# Altium schematic sheet microcontroller.SchDoc: Microcontroller
size A4; Date: 27.05.2014; Author: Stefan Lüthi; DrawnBy: Stefan Lüthi; Organization: BFH; Address1: Bern University of Applied Sciences; Address2: Engineering and Information Technology; Address3: Jlcoweg 1; Address4: CH-3400 Burgdorf; DocumentNumber: 1; Revision: 1.0; SheetNumber: 6; SheetTotal: 8; CurrentDate: 27.05.2014
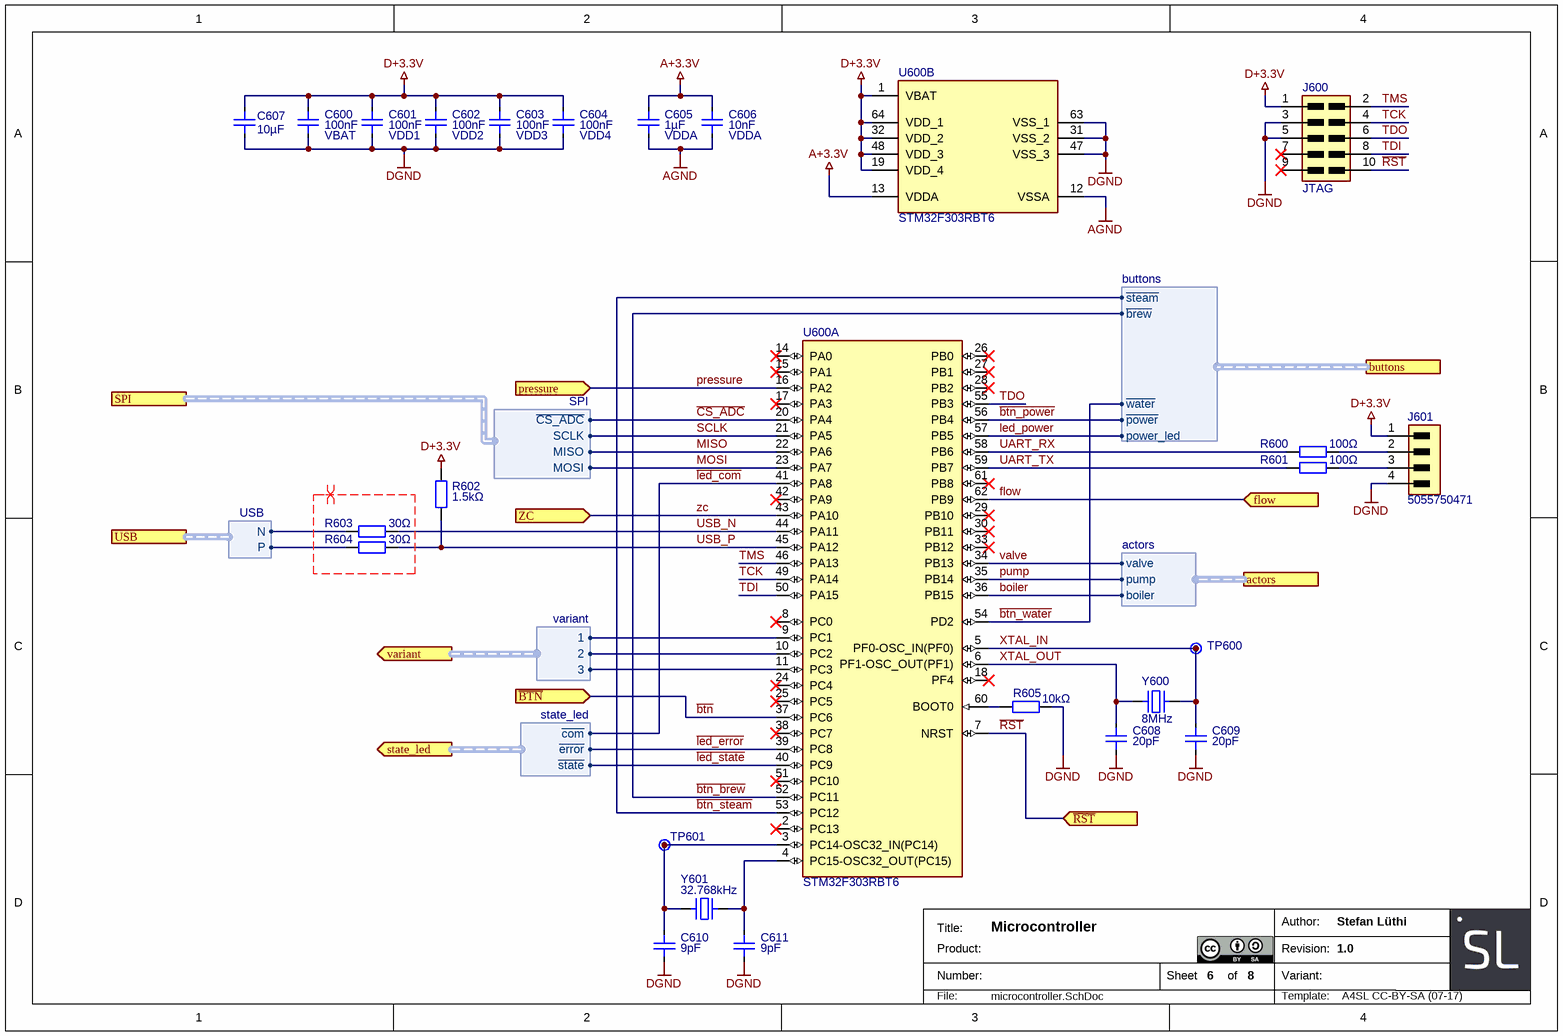
[diagram p0: microcontroller.SchDoc]

## Parts
C600  100nF  pin: VBAT  [SMD0603CAP]
C601  100nF  pin: VDD1  [SMD0603CAP]
C602  100nF  pin: VDD2  [SMD0603CAP]
C603  100nF  pin: VDD3  [SMD0603CAP]
C604  100nF  pin: VDD4  [SMD0603CAP]
C605  1µF  pin: VDDA  [SMD0603CAP]
C606  10nF  pin: VDDA  [SMD0603CAP]
C607  10µF  [SMD1206CAP]
C608  20pF  [SMD0603CAP]
C609  20pF  [SMD0603CAP]
C610  9pF  [SMD0603CAP]
C611  9pF  [SMD0603CAP]
J600  JTAG  [HEADER2X5]
J601  5055750471  [5055750471]
R600  100Ω  [SMD0603RES]
R601  100Ω  [SMD0603RES]
R602  1.5kΩ  [SMD0603RES]
R603  30Ω  [SMD0603RES]
R604  30Ω  [SMD0603RES]
R605  10kΩ  [SMD0603RES]
TP600  Testpoint  [TP]  (value not drawn)  (no BOM)
TP601  Testpoint  [TP]  (value not drawn)  (no BOM)
U600  STM32F303RBT6  [LQFP64]  (parts A,B of 2)
Y600  8MHz  [XTAL32x25]
Y601  32.768kHz  [FC-135 32.7680KA-A3]

## Ports
actors (harness actors), buttons (harness buttons), flow (in), pressure (in), SPI (harness SPI), state_led (out, harness state_led), USB (harness USB), variant (out, harness variant), ZC (in), ~{BTN} (in), ~{RST} (in)

## Harnesses
USB: N, P
SPI: MISO, MOSI, SCLK, ~{CS_ADC}
state_led: ~{com}, ~{state}, ~{error}
actors: valve, pump, boiler
buttons: ~{water}, ~{brew}, ~{steam}, ~{power}, power_led
variant: 1, 2, 3

## Nets
A+3.3V: C605.1 C606.1 U600.13(VDDA)
AGND: C605.2 C606.2 U600.12(VSSA)
D+3.3V: C600.1 C601.1 C602.1 C603.1 C604.1 C607.1 J600.1 J601.1 R602.1 U600.1(VBAT) U600.19(VDD_4) U600.32(VDD_2) U600.48(VDD_3) U600.64(VDD_1)
DGND: C600.2 C601.2 C602.2 C603.2 C604.2 C607.2 C608.2 C609.2 C610.2 C611.2 J600.3 J600.5 J601.4 R605.2 U600.31(VSS_2) U600.47(VSS_3) U600.63(VSS_1)
GND: Y600.2 Y600.4 Y601.2 Y601.4
~{btn}: U600.37(PC6) ; port ~{BTN}
~{btn_brew}: U600.52(PC11) ; port buttons.~{brew}
~{btn_power}: U600.56(PB4) ; port buttons.~{power}
~{btn_steam}: U600.53(PC12) ; port buttons.~{steam}
~{btn_water}: U600.54(PD2) ; port buttons.~{water}
~{CS_ADC}: U600.20(PA4) ; port SPI.~{CS_ADC}
~{led_com}: U600.41(PA8) ; port state_led.~{com}
~{led_error}: U600.39(PC8) ; port state_led.~{error}
~{led_state}: U600.40(PC9) ; port state_led.~{state}
~{RST}: J600.10 U600.7(NRST) ; port ~{RST}
boiler: U600.36(PB15) ; port actors.boiler
flow: U600.62(PB9) ; port flow
led_power: U600.57(PB5) ; port buttons.power_led
MISO: U600.22(PA6) ; port SPI.MISO
MOSI: U600.23(PA7) ; port SPI.MOSI
pressure: U600.16(PA2) ; port pressure
pump: U600.35(PB14) ; port actors.pump
SCLK: U600.21(PA5) ; port SPI.SCLK
TCK: J600.4 U600.49(PA14)
TDI: J600.8 U600.50(PA15)
TDO: J600.6 U600.55(PB3)
TMS: J600.2 U600.46(PA13)
UART_RX: R600.1 U600.58(PB6)
UART_TX: R601.1 U600.59(PB7)
USB_N: R603.1 U600.44(PA11)
USB_P: R602.2 R604.1 U600.45(PA12)
valve: U600.34(PB13) ; port actors.valve
XTAL_IN: C609.1 TP600.1 U600.5(PF0-OSC_IN(PF0)) Y600.3
XTAL_OUT: C608.1 U600.6(PF1-OSC_OUT(PF1)) Y600.1
zc: U600.43(PA10) ; port ZC
NetC610_1: C610.1 TP601.1 U600.3(PC14-OSC32_IN(PC14)) Y601.1
NetC611_1: C611.1 U600.4(PC15-OSC32_OUT(PC15)) Y601.3
NetJ601_2: J601.2 R600.2
NetJ601_3: J601.3 R601.2
NetR603_2: R603.2 ; port USB.N
NetR604_2: R604.2 ; port USB.P
NetR605_1: R605.1 U600.60(BOOT0)
NetU600_9: U600.9(PC1) ; port variant.1
NetU600_10: U600.10(PC2) ; port variant.2
NetU600_11: U600.11(PC3) ; port variant.3

Not connected (* = marked no-connect by the designer): J600 7* 9*; U600 2(PC13)* 8(PC0)* 14(PA0)* 15(PA1)* 17(PA3)* 18(PF4)* 24(PC4)* 25(PC5)* 26(PB0)* 27(PB1)* 28(PB2)* 29(PB10)* 30(PB11)* 33(PB12)* 38(PC7)* 42(PA9)* 51(PC10)* 61(PB8)*

## Layout directives
differential pair; rule Differential Pairs Routing [Pref Gap = 0.203mm    Min Gap  = 0.154mm    Max Gap  = 2mmPref Width = 0.175mm    Min Width  = 0.15mm    Max Width  = 1mm]: (no net found under the mark)

## Notes on the sheet
- Author:
- Title:
- Number:
- Product:
- Sheet
- of
- Variant:
- Revision:
- File:
- Template:
- A4SL CC-BY-SA (07-17)

## Library data of the parts
C600-C611 = Capacitor Ceramic: Ceramic Capacitor
J600 = 2x5P Connector: 2x5P Connector, 1.27mm
J601 = Connector 4x1P
R600-R605 = Resistor
U600 = STM32F303RBT6: ARM Cortex-M4 32-bit MCU; D/A Converter: 2x12-bit (2 Channel); FLASH Size (Prog) (kB): 128; I/Os (High Current): 52; Internal RAM Size (kB): 32; Operating Frequency(F) (Processor speed) (MHz): 72; Packing: Tray; Supply Voltage(Vcc) min (V): 2; DatasheetVersion: Rev. 6; PackageVersion: Rev. 4, 06/2013; PackageReference: LQFP64; PackageDescription: 64-Pin Low Profile Quad Flat Package, 10 x 10 mm Body, 0.5 mm Pitch; Supplier 1: Digi-Key; Supplier Part Number 1: STM32F303RBT6-ND; Supplier 2: Farnell; Supplier Part Number 2: 2333255; Supplier 3: Newark; Supplier Part Number 3: 99W9873; Supplier 4: Newark; Supplier Part Number 4: 66W7287; Supplier 5: Mouser; Supplier Part Number 5: 511-STM32F303RBT6; Core: ARM Cortex-M4; Mounting Technology: Surface Mount; PartNumber: STM32F303RBT6; ComponentLink1Description: Manufacturer URL; ComponentLink1URL: http://www.st.com/web/en/home.html; ComponentLink2Description: Datasheet; ComponentLink2URL: http://www.st.com/st-web-ui/static/active/en/resource/technical/document/datasheet/DM00058181.pdf; ComponentLink3Description: Package Specification; ComponentLink3URL: http://www.st.com/st-web-ui/static/active/en/resource/technical/document/datasheet/DM00037051.pdf
Y600 Y601 = Crystal